# EAGLE schematic for_MC_01 (EAGLE 5.00)
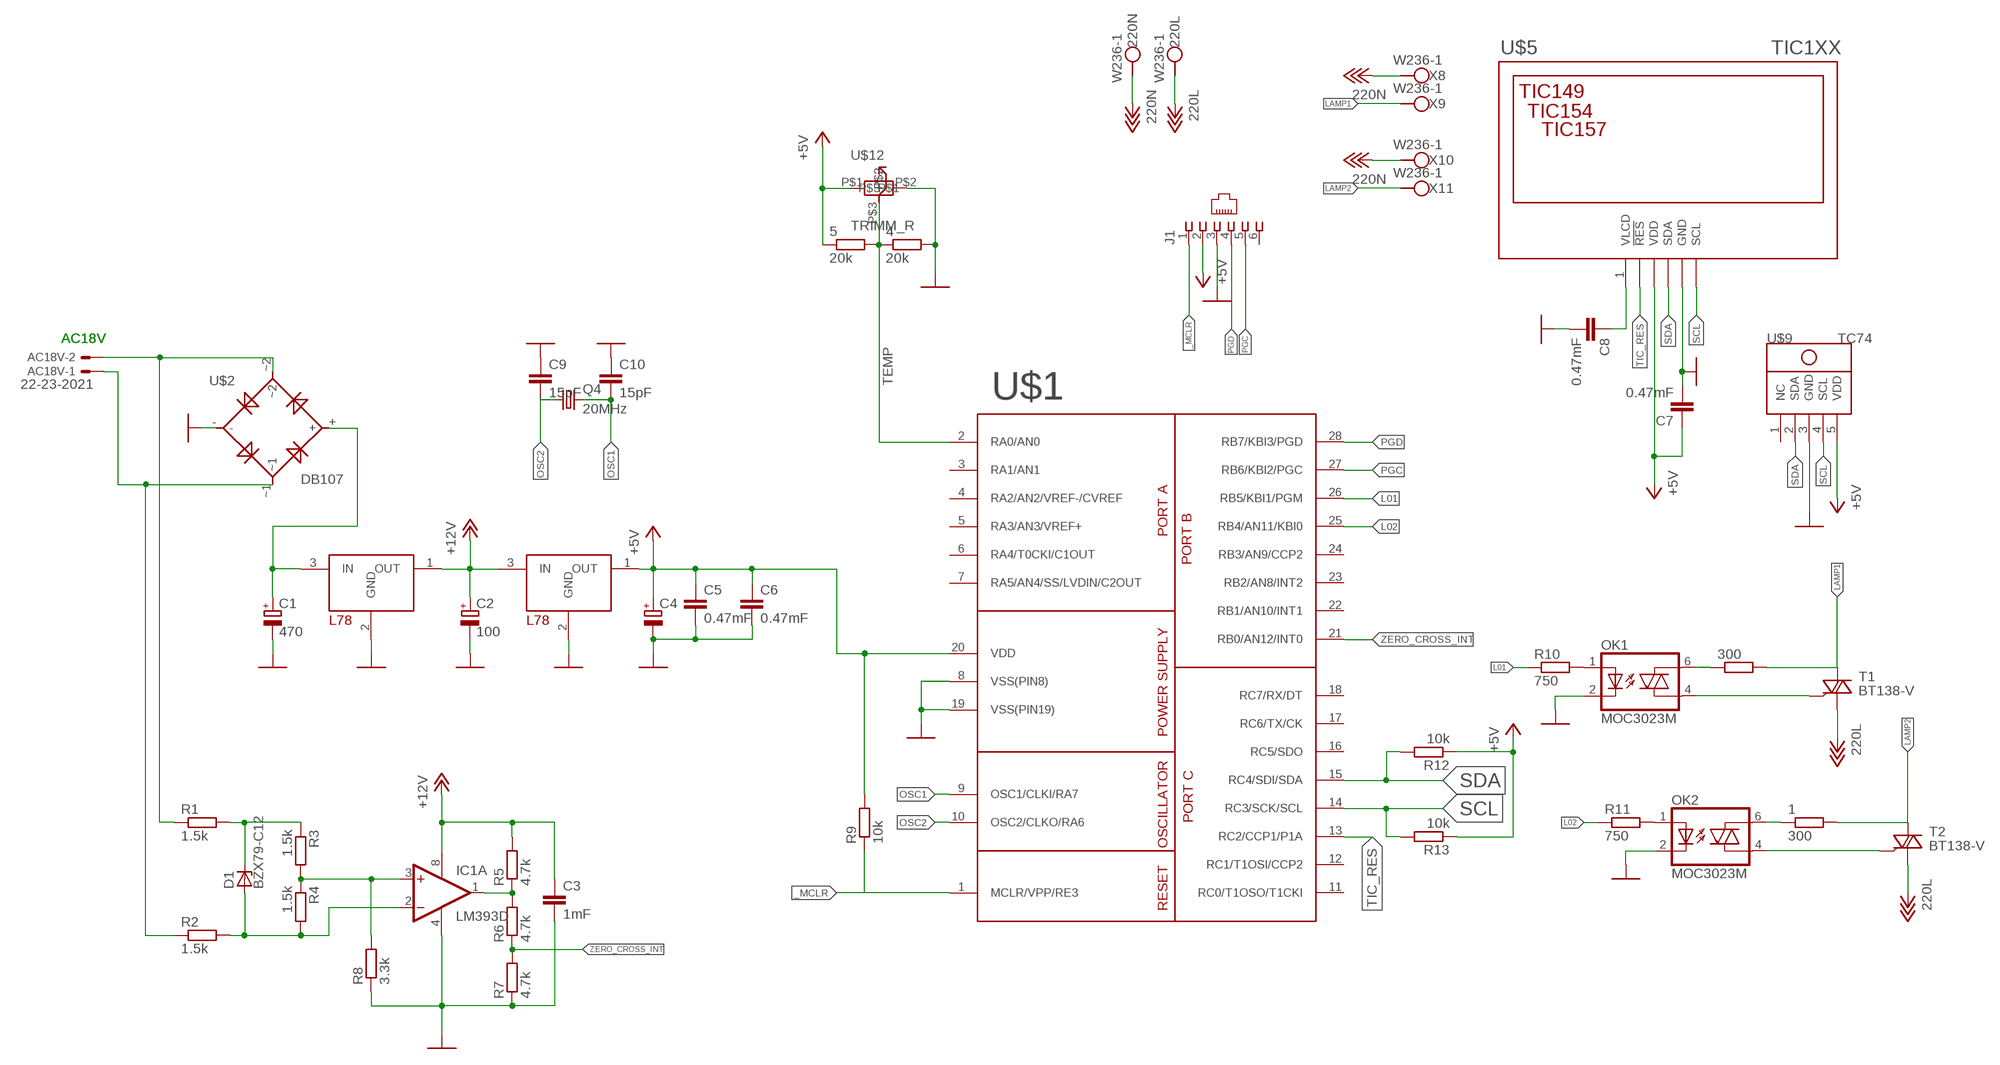
[diagram p0: schematic, sheet 1]

## Parts
1  300  R-R1206  [R1206]
4  20k  R-R1206  [R1206]
5  20k  R-R1206  [R1206]
78L05  L78  [TO92]
78L12  L78  [TO92]
220L  W236-1  [W236-1]
220N  W236-1  [W236-1]
300  R-R1206  [R1206]
AC18V  22-23-2021  [22-23-2021]
C1  470  CPOL-EUE5-8.5  [E5-8,5]
C2  100  CPOL-EUE5-8.5  [E5-8,5]
C3  1mF  C-1206  [C1206]
C4  CPOL-EUCT6032  [CT6032]
C5  0.47mF  C-1206  [C1206]
C6  0.47mF  C-1206  [C1206]
C7  0.47mF  C-1206  [C1206]
C8  0.47mF  C-1206  [C1206]
C9  15pF  C-1206  [C1206]
C10  15pF  C-1206  [C1206]
D1  BZX79-C12  BZX90  [DO34Z7]
IC1  LM393D  [SO08]
J1  520250-3  [520250-3]
OK1  MOC3023M  [DIL06]
OK2  MOC3023M  [DIL06]
Q4  20MHz  CRYTALHC49U70  [HC49U70]
R1  1.5k  R-EU_0207/10  [0207/10]
R2  1.5k  R-EU_0207/10  [0207/10]
R3  1.5k  R-EU_0207/10  [0207/10]
R4  1.5k  R-EU_0207/10  [0207/10]
R5  4.7k  R-R1206  [R1206]
R6  4.7k  R-R1206  [R1206]
R7  4.7k  R-R1206  [R1206]
R8  3.3k  R-R1206  [R1206]
R9  10k  R-R1206  [R1206]
R10  750  R-R1206  [R1206]
R11  750  R-R1206  [R1206]
R12  10k  R-R1206  [R1206]
R13  10k  R-R1206  [R1206]
T1  BT138-V  [TO220BV]
T2  BT138-V  [TO220BV]
U$1  PIC18F2320SPDIP  [SPDIP-28]
U$2  DB107  [MOST_DIP]
U$5  TIC1XX  [TIC1XX]
U$9  TC74  [TC74]
U$12  TRIMM_R  [TRIMM_R]
X8  W236-1  [W236-1]
X9  W236-1  [W236-1]
X10  W236-1  [W236-1]
X11  W236-1  [W236-1]

## Nets
220L: 220L.1(KL1) T1.T1(A1) T2.T1(A1)
220N: 220N.1(KL1) X8.1(KL1) X10.1(KL1)
+5V: 5.1 78L05.1(OUT) C4.+ C5.1 C6.1 C7.1 J1.2 R9.2 R12.1 R13.1 U$1.20(VDD) U$5.3(VDD) U$9.5(VDD) U$12.P$1
+12V: 78L05.3(IN) 78L12.1(OUT) C2.+ C3.1 IC1.8(P:V+) R5.2
_MCLR: J1.1 R9.1 U$1.1(MCLR/VPP/RE3)
GND [power]: 4.2 78L05.2(GND) 78L12.2(GND) C1.- C2.- C3.2 C4.- C5.2 C6.2 C7.2 C8.2 C9.1 C10.1 IC1.4(P:V-) J1.3 OK1.2(C) OK2.2(C) R7.1 R8.1 U$1.8(VSS(PIN8)) U$1.19(VSS(PIN19)) U$2.- U$5.5(GND) U$9.3(GND) U$12.P$2
L01: R10.1 U$1.26(RB5/KBI1/PGM)
L02: R11.1 U$1.25(RB4/AN11/KBI0)
LAMP1: 300.2 T1.T2(A2) X9.1(KL1)
LAMP2: 1.2 T2.T2(A2) X11.1(KL1)
N$1: IC1.3(A:+IN) R3.2 R4.1 R8.2
N$2: AC18V.1 R2.1 U$2.~1
N$3: IC1.1(A:OUT) R5.1 R6.2
N$4: D1.C R1.2 R3.1
N$5 [power]: 78L12.3(IN) C1.+ U$2.+
N$6: D1.A IC1.2(A:-IN) R2.2 R4.2
N$7: AC18V.2 R1.1 U$2.~2
N$8: 1.1 OK2.6(A2)
N$9: OK1.1(A) R10.2
N$10: OK1.4(A1) T1.G
N$11: 300.1 OK1.6(A2)
N$12: C8.1 U$5.1(VLCD)
N$13: OK2.1(A) R11.2
N$14: OK2.4(A1) T2.G
OSC1: C10.2 Q4.2 U$1.9(OSC1/CLKI/RA7)
OSC2: C9.2 Q4.1 U$1.10(OSC2/CLKO/RA6)
PGC: J1.5 U$1.27(RB6/KBI2/PGC)
PGD: J1.4 U$1.28(RB7/KBI3/PGD)
SCL: R13.2 U$1.14(RC3/SCK/SCL) U$5.6(SCL) U$9.4(SCL)
SDA: R12.2 U$1.15(RC4/SDI/SDA) U$5.4(SDA) U$9.2(SDA)
TEMP: 4.1 5.2 U$1.2(RA0/AN0) U$12.P$3
TIC_RES: U$5.2(!RES)
ZERO_CROSS_INT: R6.1 R7.2 U$1.21(RB0/AN12/INT0)
Unconnected: 220L.2(KL2) 220N.2(KL2) IC1.5(B:+IN) IC1.6(B:-IN) IC1.7(B:OUT) J1.6 U$1.3(RA1/AN1) U$1.4(RA2/AN2/VREF-/CVREF) U$1.5(RA3/AN3/VREF+) U$1.6(RA4/T0CKI/C1OUT) U$1.7(RA5/AN4/SS/LVDIN/C2OUT) U$1.11(RC0/T1OSO/T1CKI) U$1.12(RC1/T1OSI/CCP2) U$1.13(RC2/CCP1/P1A) U$1.16(RC5/SDO) U$1.17(RC6/TX/CK) U$1.18(RC7/RX/DT) U$1.22(RB1/AN10/INT1) U$1.23(RB2/AN8/INT2) U$1.24(RB3/AN9/CCP2) U$9.1(NC) X8.2(KL2) X9.2(KL2) X10.2(KL2) X11.2(KL2)

## Notes on the sheet
- AC18V | AC18V

## Library data of the parts
1 4 5 300 R5-R13 = quantum-sensor:R: Resistor
78L05 78L12 = TO92:L78: L78 TO92
220L 220N X8-X11 = con-wago-508:W236-1: WAGO SREW CLAMP
AC18V = con-molex:22-23-2021: .100" (2.54mm) Center Header - 2 Pin
C1 C2 C4 = rcl:CPOL-EU: POLARIZED CAPACITOR, European symbol
C3 C5-C10 = quantum-sensor:C: Capacitor
D1 = diode:BZX90: Z DIODE
IC1 = linear:LM393: COMPARATOR
J1 = con-amp:520250-3: AMP connector
OK1 OK2 = optocoupler:MOC30*M: RANDOM-PHASE OPTOISOLATORS TRIAC DRIVER OUTPUT Source: http://www.fairchildsemi.com MOC3020-M.pdf
Q4 = crystal:CRYTAL: CRYSTAL
R1-R4 = rcl:R-EU_: RESISTOR, European symbol
T1 T2 = triac:BT138: TRIAC Source: http://www.semiconductors.philips.com BT138_SERIES_2.pdf
U$1 = pic18f2320:PIC18F2320
U$2 = diode_most:DB107: DB107 diode
U$5 = TIC:TIC1XX: TIC TIC1xx TIC149 TIC154 TIC157
U$9 = microchip_tc74:TC74: tc74 to-220
U$12 = trimm_r:TRIMM_R: TRIMM resistor R TRIMM_R

## Net classes
1 power: width 0.762 mm